# EasyEDA Pro project Schematic1_2023-10-10.epro

# Schematic Schematic1
Create Date: 2023-10-07; Page Name: P1; Project Name: circuller; Schematic Name: Schematic1; Update Date: 2023-10-08; Company: MPAM Lab; Page Size: A3; Version: 0.1
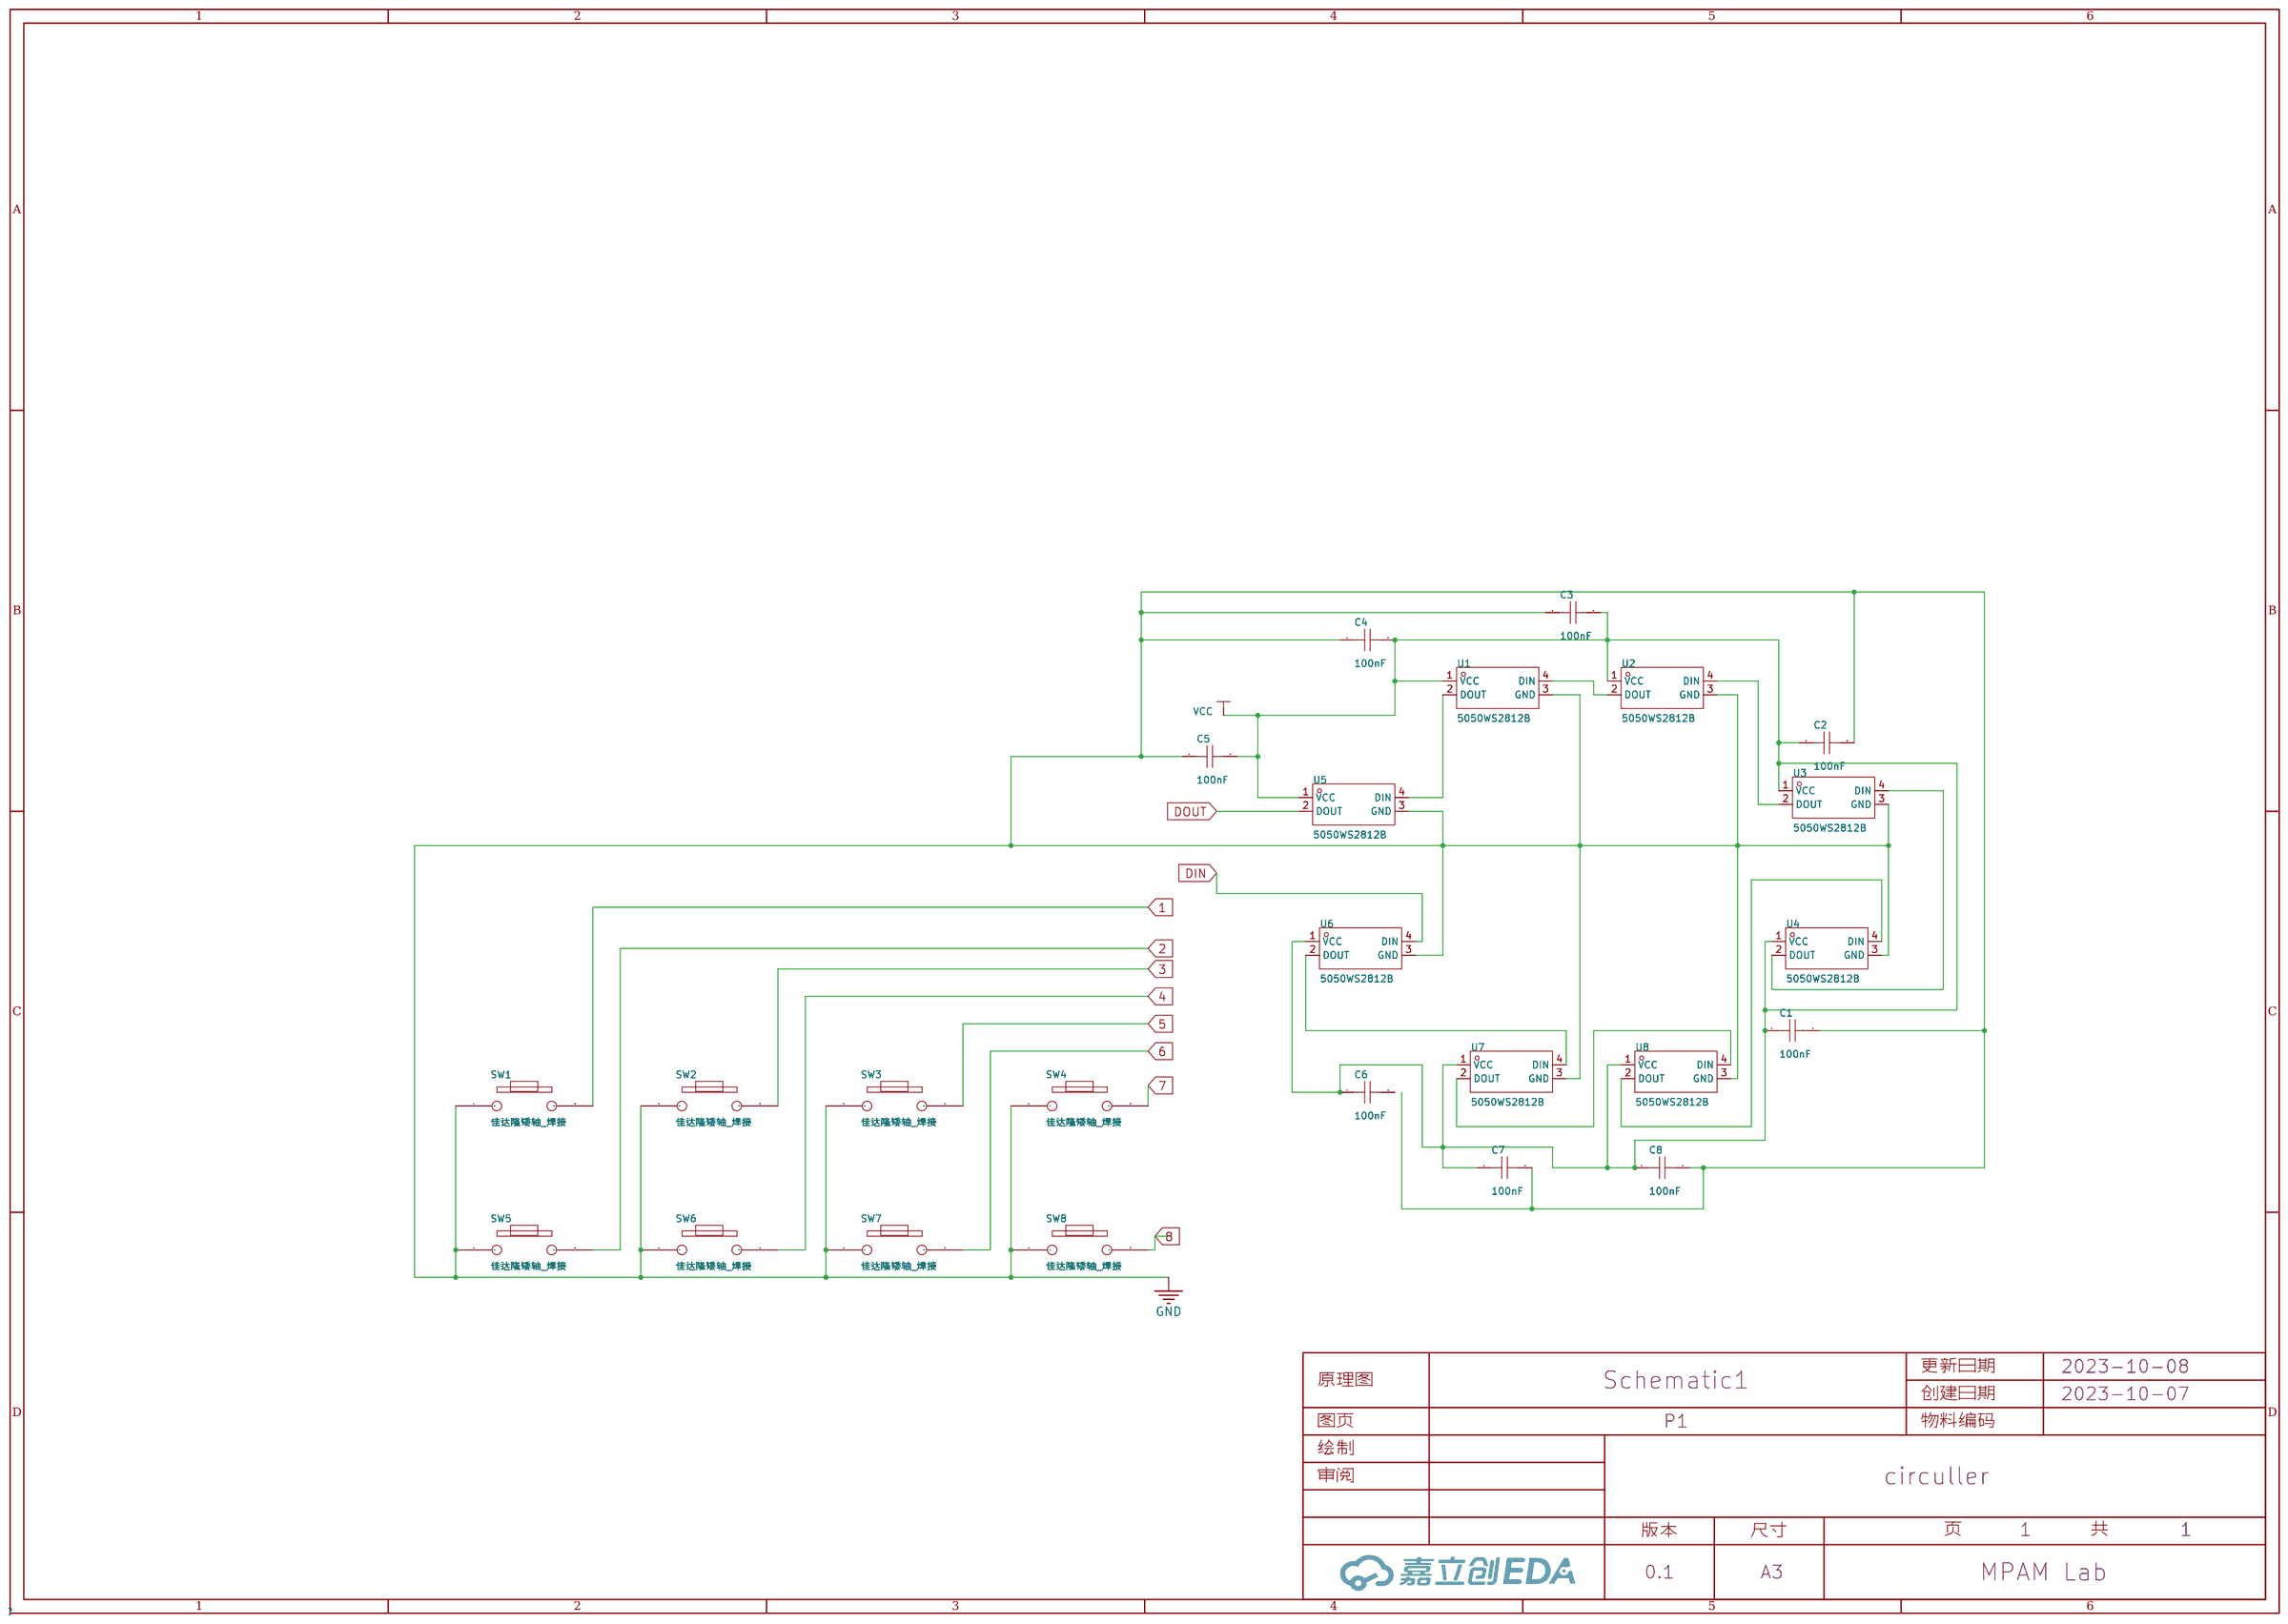
[diagram p0: schematic sheet]

## Parts
C1  100nF  [C0603]
C2  100nF  [C0603]
C3  100nF  [C0603]
C4  100nF  [C0603]
C5  100nF  [C0603]
C6  100nF  [C0603]
C7  100nF  [C0603]
C8  100nF  [C0603]
SW1  佳达隆矮轴_焊接  [GATERON佳达隆矮轴热插拔]
SW2  佳达隆矮轴_焊接  [GATERON佳达隆矮轴热插拔]
SW3  佳达隆矮轴_焊接  [GATERON佳达隆矮轴热插拔]
SW4  佳达隆矮轴_焊接  [GATERON佳达隆矮轴热插拔]
SW5  佳达隆矮轴_焊接  [GATERON佳达隆矮轴热插拔]
SW6  佳达隆矮轴_焊接  [GATERON佳达隆矮轴热插拔]
SW7  佳达隆矮轴_焊接  [GATERON佳达隆矮轴热插拔]
SW8  佳达隆矮轴_焊接  [GATERON佳达隆矮轴热插拔]
U1  5050WS2812B  [LED-SMD_5050WS2812B]
U2  5050WS2812B  [LED-SMD_5050WS2812B]
U3  5050WS2812B  [LED-SMD_5050WS2812B]
U4  5050WS2812B  [LED-SMD_5050WS2812B]
U5  5050WS2812B  [LED-SMD_5050WS2812B]
U6  5050WS2812B  [LED-SMD_5050WS2812B]
U7  5050WS2812B  [LED-SMD_5050WS2812B]
U8  5050WS2812B  [LED-SMD_5050WS2812B]

## Library data of the parts
C1-C8 = CAP_0603: Supplier Footprint: 0603
SW1-SW8 = 佳达隆矮轴_焊接: Supplier: eyy
U1-U8 = 5050WS2812B: Supplier Part: C2874876; Supplier Footprint: LED-SMD-4_L5.0-W5.0-P3.20-LS5.4; JLCPCB Part Class: 扩展库; Datasheet: 2021-08-01/763763S/fc73e402754744b5b9326c8825dec5cc/ws2812B.pdf; Supplier: LCSC

## Nets
GND: C1.2 C2.2 C3.1 C4.1 C5.1 C7.2 C8.2 SW1.1 SW2.1 SW3.1 SW4.1 SW5.1 SW6.1 SW7.1 SW8.1 U1.3(GND) U2.3(GND) U3.3(GND) U4.3(GND) U5.3(GND) U6.3(GND) U7.3(GND) U8.3(GND)
VCC: C1.1 C2.1 C3.2 C4.2 C5.2 C6.1 C7.1 C8.1 U1.1(VCC) U2.1(VCC) U3.1(VCC) U4.1(VCC) U5.1(VCC) U6.1(VCC) U7.1(VCC) U8.1(VCC)
1: SW1.2
2: SW5.2
3: SW2.2
4: SW6.2
5: SW3.2
6: SW7.2
7: SW4.2
8: SW8.2
DIN: U6.4(DIN)
DOUT: U5.2(DOUT)
Net-(U1-2): U1.2(DOUT) U5.4(DIN)
Net-(U1-4): U1.4(DIN) U2.2(DOUT)
Net-(U2-4): U2.4(DIN) U3.2(DOUT)
Net-(U3-4): U3.4(DIN) U4.2(DOUT)
Net-(U4-4): U4.4(DIN) U8.2(DOUT)
Net-(U6-2): U6.2(DOUT) U7.4(DIN)
Net-(U7-2): U7.2(DOUT) U8.4(DIN)

Not connected (* = marked no-connect by the designer): C6 2
